# Altium schematic sheet Power 12V to servo.SchDoc
size A4; SheetNumber: 2; SheetTotal: 3
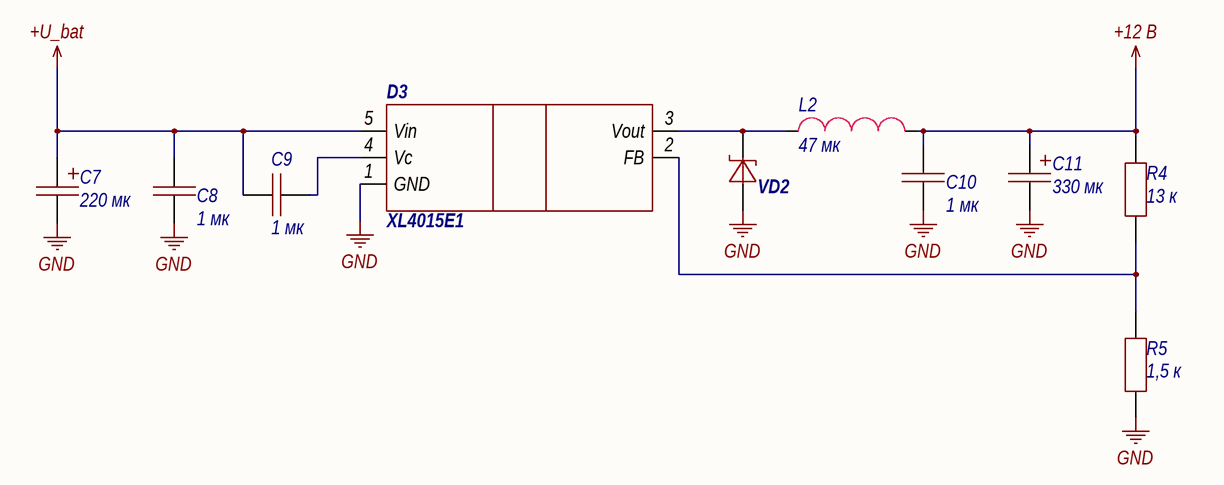
[diagram p0: Power 12V to servo.SchDoc]

## Parts
C7  value 220 мк  [RADIAL-2 10MM]  (hidden comment: Конденсатор полевой)
C8  value 1 мк  [0603C]  (hidden comment: Конденсатор)
C9  value 1 мк  [0603C]  (hidden comment: Конденсатор)
C10  value 1 мк  [0603C]  (hidden comment: Конденсатор)
C11  value 330 мк  [RADIAL-2 10MM]  (hidden comment: Конденсатор полевой)
D3  XL4015E1  [TO-263-5]
L2  value 47 мк  [IHLP-6767]  (hidden comment: Inductance)
R4  value 13 к  [0603R]  (hidden comment: Resistor)
R5  value 1,5 к  [0603R]  (hidden comment: Resistor)
VD2  Диод Шоттки  [SMC]  (value not drawn)

## Nets
+12 В: C10.1 C11.1 L2.2 R4.2
+U_bat: C7.1 C8.2 C9.2 D3.5(Vin)
GND: C7.2 C8.1 C10.2 C11.2 D3.1(GND) R5.1 VD2.1
NetC9_1: C9.1 D3.4(Vc)
NetD3_2: D3.2(FB) R4.1 R5.2
NetD3_3: D3.3(Vout) L2.1 VD2.2

## Library data of the parts
C7 = Capacitor_pol: Конденсатор электролит. 220 мкФ, 50 В, 10мм
C8-C10 = Capacitor: Конденсатор керамический SMD, 1 мкФ, 0603
C11 = Capacitor_pol: Конденсатор электролит. 330 мкФ, 25 В, 10 мм
D3 = XL4015E1: Импульсный DC-DC преобразователь. Вход до 36 В. Регулируемый выход. Выходной ток до 5А.
L2 = Inductance: Индуктивность экранированная 47 мкГн, 20%, 8.7 А, 42.7 мОм, IHLP6767GZER470M11
R4 = Resistor: Резистор SMD, 0603, 13 кОм; Power: *
R5 = Resistor: Резистор SMD 0603, 1.5 кОм; Power: *
VD2 = Schottky diode: Диод Шоттки 40 В, 5 А, SMC, B540C-13-F; Value: {Номинал}